# Altium schematic sheet MCU.SchDoc
size A4; DocumentNumber: 4; SheetNumber: 4; SheetTotal: 4
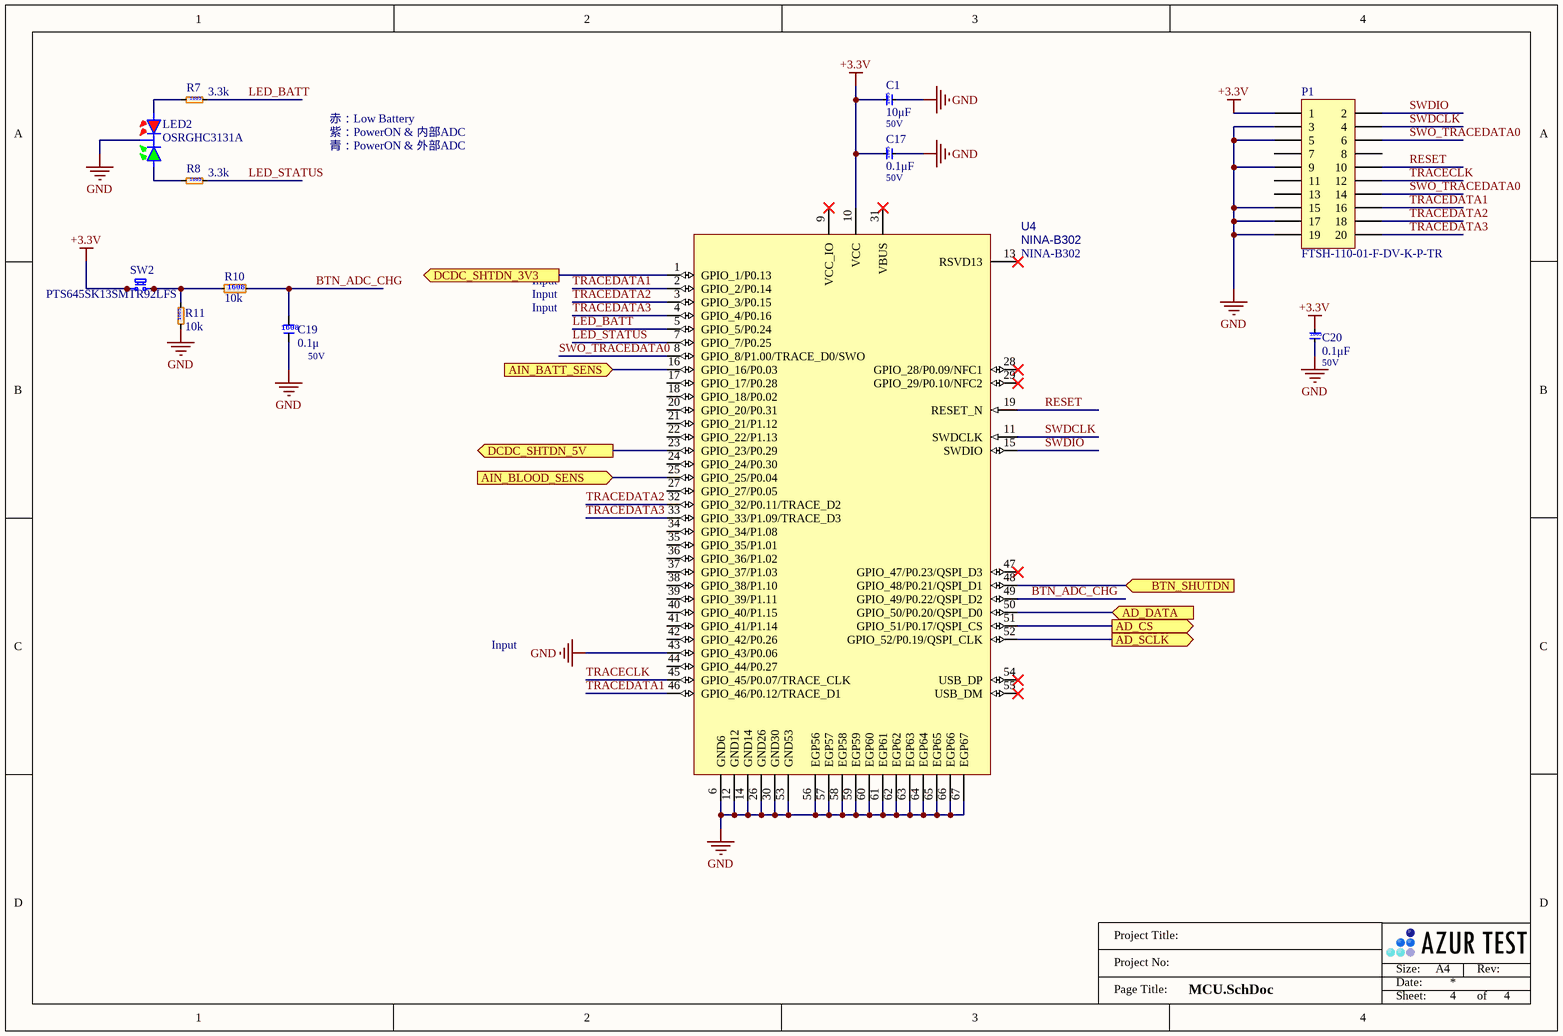
[diagram p0: MCU.SchDoc]

## Parts
C1  Tag: 10μF  Voltage: 50V  [C1005]  (hidden comment: GRM155F11H103Z)
C17  Tag: 0.1μF  Voltage: 50V  [C1005]  (hidden comment: GRM1552C1H101J)
C19  Tag: 0.1μ  Voltage: 50V  [C1608]  (hidden comment: GRM1885C1H101JA01D)
C20  Tag: 0.1μF  Voltage: 50V  [C1005]  (hidden comment: GRM1552C1H101J)
LED2  OSRGHC3131A  [LED3COLORS]
P1  FTSH-110-01-F-DV-K-P-TR  [Headerpin 2x10]
R7  Tag: 3.3k  [R1005]  (hidden comment: RG1005P-332-B-T5)
R8  Tag: 3.3k  [R1005]  (hidden comment: RG1005P-332-B-T5)
R10  Tag: 10k  [R1608]  (hidden comment: RG1608P-103-B-T5)
R11  Tag: 10k  [R1005]  (hidden comment: RG1005P-103-B-T5)
SW2  PTS645SK13SMTR92LFS  [PTS645SK13SMTR92LFS]
U4  NINA-B302  [NINA_LGA67R_1500X1000X338_PIFA]

## Ports
AD_CS (out), AD_DATA (in), AD_SCLK (out), AIN_BATT_SENS (in), AIN_BLOOD_SENS (in), BTN_SHUTDN (in), DCDC_SHTDN_3V3 (out), DCDC_SHTDN_5V (out)

## Nets
+3.3V: C1.2 C17.2 C20.2 P1.1 SW2.1 SW2.2 U4.10(VCC)
GND: C1.1 C17.1 C19.1 C20.1 LED2.2(K) P1.3 P1.5 P1.9 P1.15 P1.17 P1.19 R11.1 U4.6(GND6) U4.12(GND12) U4.14(GND14) U4.26(GND26) U4.30(GND30) U4.43(GPIO_43/P0.06) U4.53(GND53) U4.56(EGP56) U4.57(EGP57) U4.58(EGP58) U4.59(EGP59) U4.60(EGP60) U4.61(EGP61) U4.62(EGP62) U4.63(EGP63) U4.64(EGP64) U4.65(EGP65) U4.66(EGP66) U4.67(EGP67)
AD_CS: U4.51(GPIO_51/P0.17/QSPI_CS) ; port AD_CS
AD_DATA: U4.50(GPIO_50/P0.20/QSPI_D0) ; port AD_DATA
AD_SCLK: U4.52(GPIO_52/P0.19/QSPI_CLK) ; port AD_SCLK
AIN_BATT_SENS: U4.16(GPIO_16/P0.03) ; port AIN_BATT_SENS
AIN_BLOOD_SENS: U4.25(GPIO_25/P0.04) ; port AIN_BLOOD_SENS
BTN_ADC_CHG: C19.2 R10.2 U4.49(GPIO_49/P0.22/QSPI_D2)
BTN_SHUTDN: U4.48(GPIO_48/P0.21/QSPI_D1) ; port BTN_SHUTDN
DCDC_SHTDN_3V3: U4.1(GPIO_1/P0.13) ; port DCDC_SHTDN_3V3
DCDC_SHTDN_5V: U4.23(GPIO_23/P0.29) ; port DCDC_SHTDN_5V
LED_BATT: R7.2 U4.5(GPIO_5/P0.24)
LED_STATUS: R8.2 U4.7(GPIO_7/P0.25)
RESET: P1.10 U4.19(RESET_N)
SWDCLK: P1.4 U4.11(SWDCLK)
SWDIO: P1.2 U4.15(SWDIO)
SWO_TRACEDATA0: P1.6 P1.14 U4.8(GPIO_8/P1.00/TRACE_D0/SWO)
TRACECLK: P1.12 U4.45(GPIO_45/P0.07/TRACE_CLK)
TRACEDATA1: P1.16 U4.2(GPIO_2/P0.14) U4.46(GPIO_46/P0.12/TRACE_D1)
TRACEDATA2: P1.18 U4.3(GPIO_3/P0.15) U4.32(GPIO_32/P0.11/TRACE_D2)
TRACEDATA3: P1.20 U4.4(GPIO_4/P0.16) U4.33(GPIO_33/P1.09/TRACE_D3)
NetLED2_1: LED2.1(A) R8.1
NetLED2_3: LED2.3(C) R7.1
NetR10_1: R10.1 R11.2 SW2.3 SW2.4

Not connected (* = marked no-connect by the designer): P1 7 8 11 13; U4 9(VCC_IO)* 13(RSVD13)* 17(GPIO_17/P0.28) 18(GPIO_18/P0.02) 20(GPIO_20/P0.31) 21(GPIO_21/P1.12) 22(GPIO_22/P1.13) 24(GPIO_24/P0.30) 27(GPIO_27/P0.05) 28(GPIO_28/P0.09/NFC1)* 29(GPIO_29/P0.10/NFC2)* 31(VBUS)* 34(GPIO_34/P1.08) 35(GPIO_35/P1.01) 36(GPIO_36/P1.02) 37(GPIO_37/P1.03) 38(GPIO_38/P1.10) 39(GPIO_39/P1.11) 40(GPIO_40/P1.15) 41(GPIO_41/P1.14) 42(GPIO_42/P0.26) 44(GPIO_44/P0.27) 47(GPIO_47/P0.23/QSPI_D3)* 54(USB_DP)* 55(USB_DM)*

## Notes on the sheet
- 赤：Low Battery
- 紫：PowerON & 内部ADC
- 青：PowerON & 外部ADC
- Input
- Project Title:
- Project No:
- Size:
- Date:
- A4
- Rev:
- Page Title:
- Sheet:
- of
- (in symbol C1005) 1005
- (in symbol C1608) 1608
- (in symbol MF1005) 1005
- (in symbol MF1608) 1608

## Library data of the parts
C1 C17 C20 = C1005: セラコン1005サイズ; Vendor: murata
C19 = C1608: セラコン1608サイズ; Vendor: murata
LED2 = OSRGHC3131A: 2色LED（赤,青）; Vendor: AKIZUKI
P1 = FTSH-110-01-F-DV-K-P-TR: Header, 2 x 10 -Pin 1.27mm
R7 R8 R11 = MF1005: 薄膜チップ抵抗1005サイズ; Vendor: susumu
R10 = MF1608: 薄膜チップ抵抗1608サイズ; Vendor: susumu
SW2 = PTS645SK13SMTR92LFS: Tactile Switch 6 x 6mm; Vendor: C&K
U4 = NINA-B302: u-blox NINA-B302 Bluetooth 5 LE, 802.15.4 module; Part Description: Stand-alone Bluetooth low energy module; Manufacturer: u-blox; Value: NINA-B302